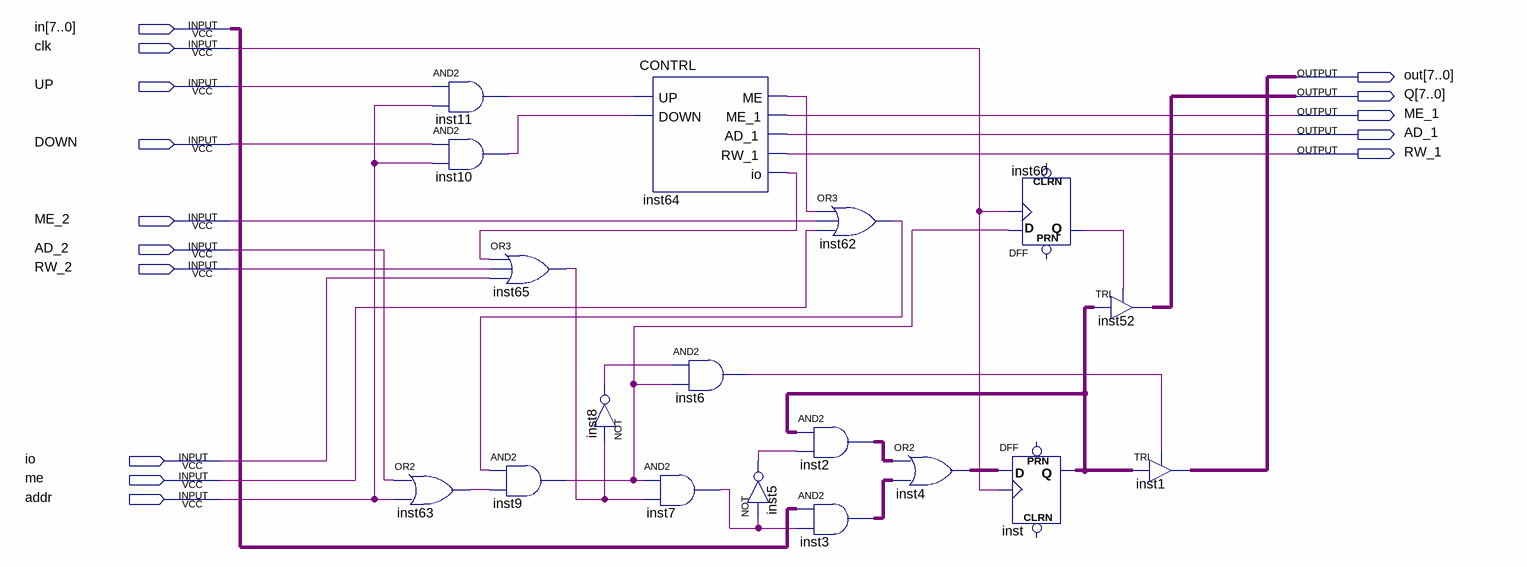
[diagram p0: schematic sheet]
// Quartus schematic tag_e1.bdf as structural Verilog: 18 symbols, 15 pins
module tag_e1 (
  input  [7:0] in,
  input  clk,
  input  UP,
  input  DOWN,
  input  ME_2,
  input  AD_2,
  input  RW_2,
  input  io,
  input  me,
  input  addr,
  output [7:0] out,
  output [7:0] Q,
  output ME_1,
  output AD_1,
  output RW_1
);

  wire inst5_out, inst6_out, inst7_out, inst8_out, inst9_out, inst10_out, inst11_out, inst60_q, inst62_out,
       inst63_out, inst64_io, inst64_me, inst65_out;
  wire [7:0] inst2_out, inst3_out, inst4_out, inst_q;

  or inst63 (inst63_out, AD_2, addr);
  and inst11 (inst11_out, UP, addr);
  and inst10 (inst10_out, DOWN, addr);
  or inst65 (inst65_out, inst64_io, RW_2, io);
  and inst9 (inst9_out, inst62_out, inst63_out);
  not inst8 (inst8_out, inst65_out);
  CONTRL inst64 (
    .UP(inst11_out), .DOWN(inst10_out), .ME(inst64_me), .ME_1(ME_1), .AD_1(AD_1), .RW_1(RW_1), .io(inst64_io));
  and inst6 (inst6_out, inst8_out, inst9_out);
  and inst7 (inst7_out, inst9_out, inst65_out);
  not inst5 (inst5_out, inst7_out);
  or inst62 (inst62_out, inst64_me, ME_2, me);
  assign inst2_out = inst_q & {8{inst5_out}};  // AND2 inst2, 8 bits wide
  assign inst3_out = in & {8{inst7_out}};  // AND2 inst3, 8 bits wide
  assign inst4_out = inst2_out | inst3_out;  // OR2 inst4, 8 bits wide
  DFF inst60 (.CLK(clk), .D(inst9_out), .Q(inst60_q));  // open: CLRN, PRN
  DFF inst[7:0] (.CLK(clk), .D(inst4_out), .Q(inst_q));  // open: CLRN, PRN
  TRI inst52[7:0] (.IN(inst_q), .OE(inst60_q), .OUT(Q));
  TRI inst1[7:0] (.IN(inst_q), .OE(inst6_out), .OUT(out));
endmodule
